# Altium schematic sheet imu.SchDoc
size A4
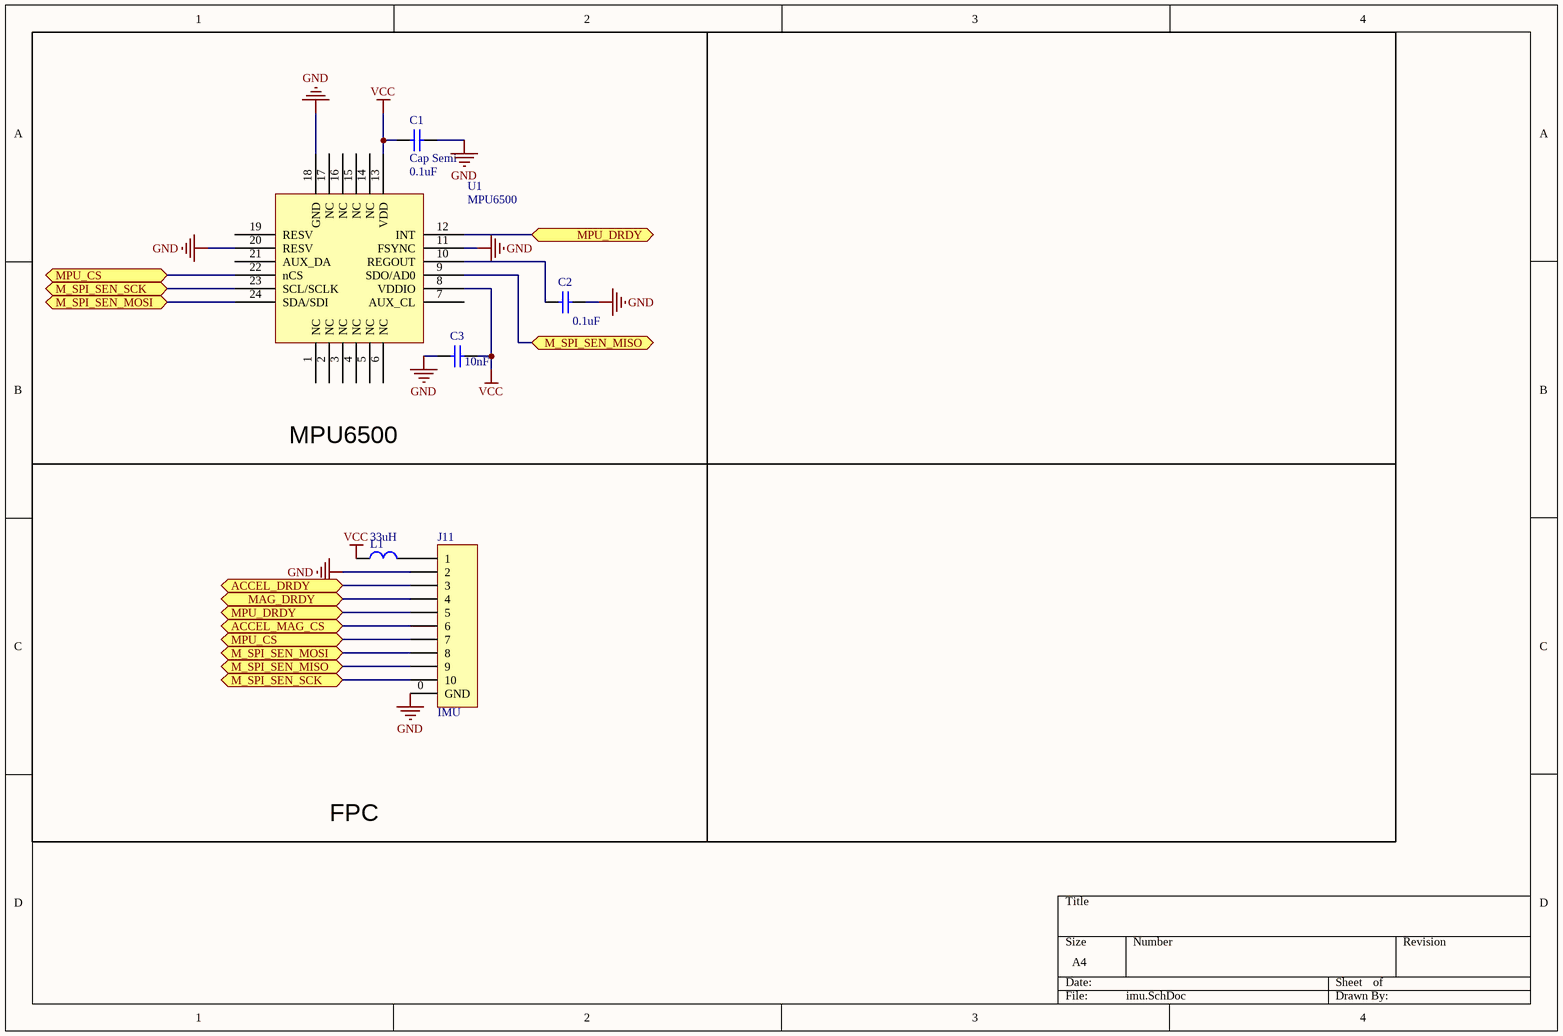
[diagram p0: imu.SchDoc]

## Parts
C1  Cap Semi  value 0.1uF  [1608[0603]]
C2  value 0.1uF  [1608[0603]]  (hidden comment: Cap Semi)
C3  value 10nF  [1608[0603]]  (hidden comment: Cap Semi)
J11  IMU  [fpc_10Pin]
L1  33uH  [J1-0603]
U1  MPU6500  [QFN40-MPU6500]

## Ports
ACCEL_DRDY, ACCEL_MAG_CS, M_SPI_SEN_MISO, M_SPI_SEN_MOSI, M_SPI_SEN_SCK, MAG_DRDY, MPU_CS, MPU_DRDY

## Nets
GND: C1.1 C2.1 C3.2 J11.0(GND) J11.2 U1.11(FSYNC) U1.18(GND) U1.20(RESV)
VCC: C1.2 C3.1 L1.1 U1.8(VDDIO) U1.13(VDD)
ACCEL_DRDY: J11.3 ; port ACCEL_DRDY
ACCEL_MAG_CS: J11.6 ; port ACCEL_MAG_CS
M_SPI_SEN_MISO: J11.9 U1.9(SDO/AD0) ; port M_SPI_SEN_MISO
M_SPI_SEN_MOSI: J11.8 U1.24(SDA/SDI) ; port M_SPI_SEN_MOSI
M_SPI_SEN_SCK: J11.10 U1.23(SCL/SCLK) ; port M_SPI_SEN_SCK
MAG_DRDY: J11.4 ; port MAG_DRDY
MPU_CS: J11.7 U1.22(nCS) ; port MPU_CS
MPU_DRDY: J11.5 U1.12(INT) ; port MPU_DRDY
NetC2_2: C2.2 U1.10(REGOUT)
NetJ11_1: J11.1 L1.2

Not connected (* = marked no-connect by the designer): U1 1(NC) 2(NC) 3(NC) 4(NC) 5(NC) 6(NC) 7(AUX_CL) 14(NC) 15(NC) 16(NC) 17(NC) 19(RESV) 21(AUX_DA)

## Notes on the sheet
- MPU6500
- FPC

## Library data of the parts
C1-C3 = Cap Semi: Capacitor (Semiconductor SIM Model); Published: 8-Jun-2000; LatestRevisionDate: 29-May-2009; LatestRevisionNote: IPC-7351 Footprint Added.; PackageReference: C1206; Publisher: Altium Limited; PackageDescription: Chip Capacitor
J11 = DF13_10: Header, 8-Pin; LatestRevisionDate: 17-Jul-2002; LatestRevisionNote: Re-released for DXP Platform.; Publisher: Altium Limited
L1 = Inductor_smt: Inductor; Code_IEC: 1005; Published: 8-Jun-2000; LatestRevisionDate: 29-May-2009; LatestRevisionNote: IPC-7351 Footprint Added.; PackageReference: 0402-A; Publisher: Altium Limited; PackageDescription: Chip Inductor; Code_JEITA: 0402
U1 = Component_1